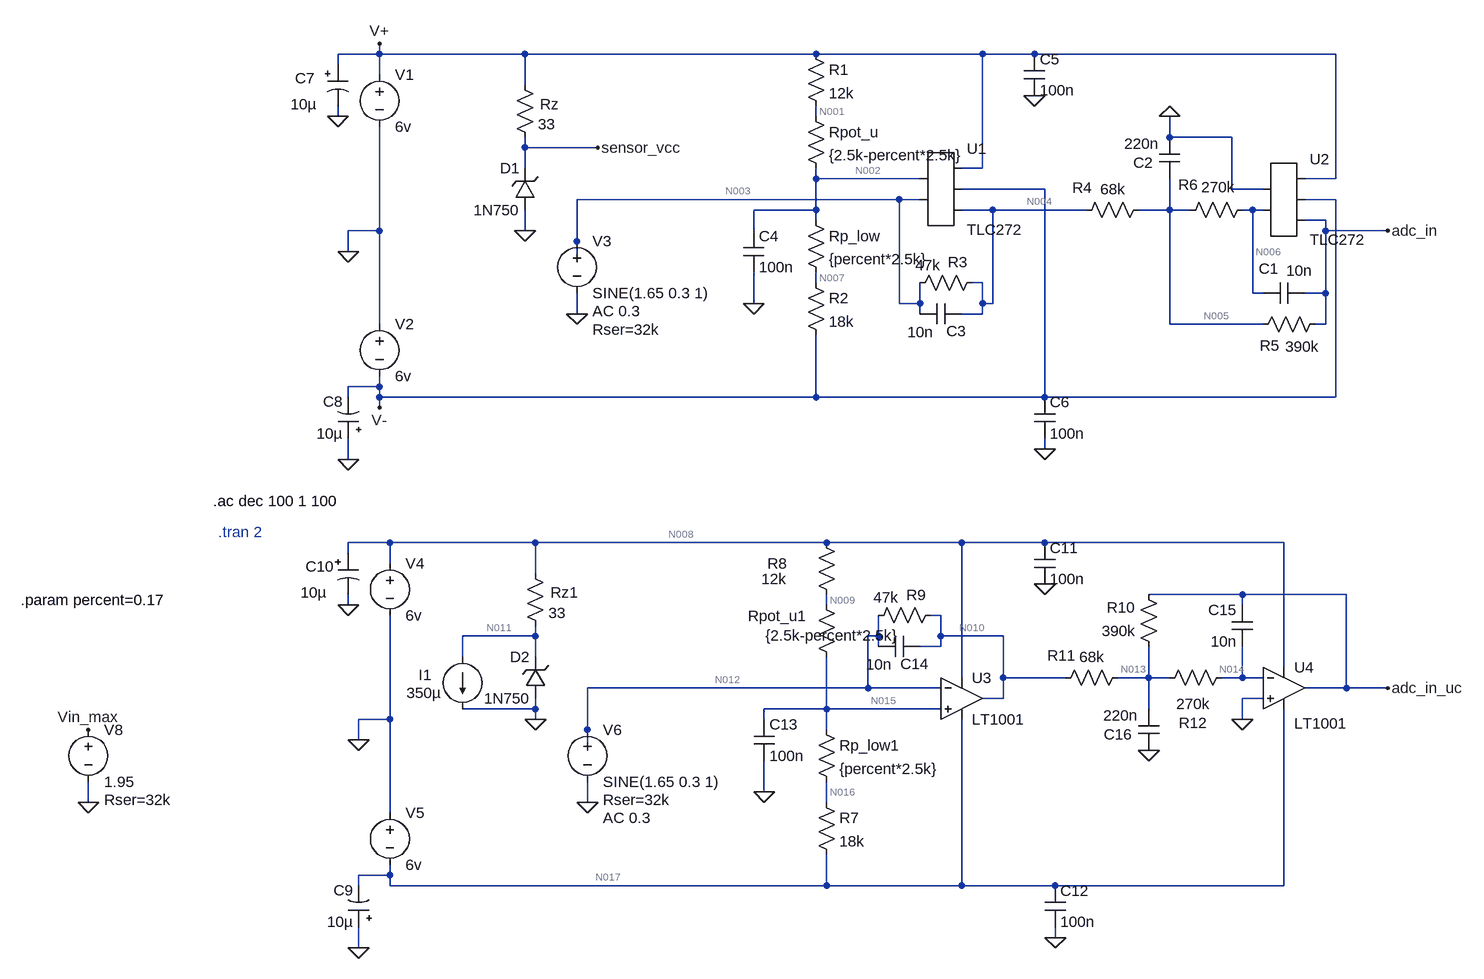
[diagram p0: schematic acceleration_measurement_lab2_draft2.asc]
* acceleration_measurement_lab2_draft2.asc
* U1: TLC272 (symbol AutoGenerated\TLC272 not available, pins judged from their places): pin1=N002 pin2=N003 pin3=V+ pin4=V- pin5=N004
* U2: TLC272 (symbol AutoGenerated\TLC272 not available, pins judged from their places): pin1=0 pin2=N006 pin3=V+ pin4=V- pin5=adc_in
D1 0 sensor_vcc 1N750
Rz V+ sensor_vcc 33
V1 V+ 0 6v
V2 0 V- 6v
V3 N003 0 SINE(1.65 0.3 1) AC 0.3 Rser=32k
C8 0 V- 10µ
C7 V+ 0 10µ
C5 V+ 0 100n
C6 V- 0 100n
R2 N007 V- 18k
Rp_low N002 N007 {percent*2.5k}
R1 V+ N001 12k
Rpot_u N001 N002 {2.5k-percent*2.5k}
C4 N002 0 100n
R3 N004 N003 47k
C3 N004 N003 10n
R5 adc_in N005 390k
R4 N005 N004 68k
R6 N006 N005 270k
C1 adc_in N006 10n
C2 N005 0 220n
D2 0 N011 1N750
Rz1 N008 N011 33
V4 N008 0 6v
V5 0 N017 6v
V6 N012 0 SINE(1.65 0.3 1) AC 0.3 Rser=32k
C9 0 N017 10µ
C10 N008 0 10µ
C11 N008 0 100n
C12 N017 0 100n
R7 N016 N017 18k
Rp_low1 N015 N016 {percent*2.5k}
R8 N008 N009 12k
Rpot_u1 N009 N015 {2.5k-percent*2.5k}
C13 N015 0 100n
R9 N010 N012 47k
C14 N010 N012 10n
R10 N013 adc_in_uc 390k
R11 N013 N010 68k
R12 N014 N013 270k
C15 N014 adc_in_uc 10n
C16 0 N013 220n
XU3 N015 N012 N008 N017 N010 LT1001  ; pins In+ In- V+ V- OUT
XU4 0 N014 N008 N017 adc_in_uc LT1001  ; pins In+ In- V+ V- OUT
I1 N011 0 350µ
V8 Vin_max 0 1.95 Rser=32k
.model D D
.lib standard.dio
.ac dec 100 1 100
* .tran 2
.param percent=0.17
.lib LTC.lib
.backanno
.end

* Results of the author's LTspice run, read from the files saved beside the schematic
* Operating Point, zero values left out:
*   V(n004) = -443.5 mV
*   V(v-) = -6 V
*   V(v+) = 6 V
*   V(n003) = 802 mV
*   V(n002) = 803.1 mV
*   V(adc_in) = 2.536 V
*   V(n006) = -1.135 mV
*   V(sensor_vcc) = 4.735 V
*   V(n007) = 646.2 mV
*   V(n001) = 1.569 V
*   V(n005) = -1.135 mV
*   V(n011) = 4.735 V
*   V(n008) = 6 V
*   V(n017) = -6 V
*   V(n012) = 803.1 mV
*   V(n016) = 646.2 mV
*   V(n015) = 803.1 mV
*   V(n009) = 1.569 V
*   V(n010) = -440.8 mV
*   V(n013) = -3.4 µV
*   V(adc_in_uc) = 2.528 V
*   V(n014) = -3.388 µV
*   V(vin_max) = 1.95 V
*   I(D2) = -37.99 mA
*   I(D1) = -38.33 mA
*   I(I1) = 350 µA
*   I(R11) = 6.483 µA
*   I(R10) = -6.483 µA
*   I(R9) = -26.47 µA
*   I(Rpot_u1) = 369.2 µA
*   I(R8) = 369.2 µA
*   I(Rp_low1) = 369.2 µA
*   I(R7) = 369.2 µA
*   I(Rz1) = 38.34 mA
*   I(R6) = -1.724 pA
*   I(R4) = 6.506 µA
*   I(R5) = 6.506 µA
*   I(R3) = -26.5 µA
*   I(Rpot_u) = 369.2 µA
*   I(R1) = 369.2 µA
*   I(Rp_low) = 369.2 µA
*   I(R2) = 369.2 µA
*   I(Rz) = 38.33 mA
*   I(V6) = -26.47 µA
*   I(V5) = -4.882 mA
*   I(V4) = -43.2 mA
*   I(V3) = -26.5 µA
*   I(V2) = -2.269 mA
*   I(V1) = -40.6 mA
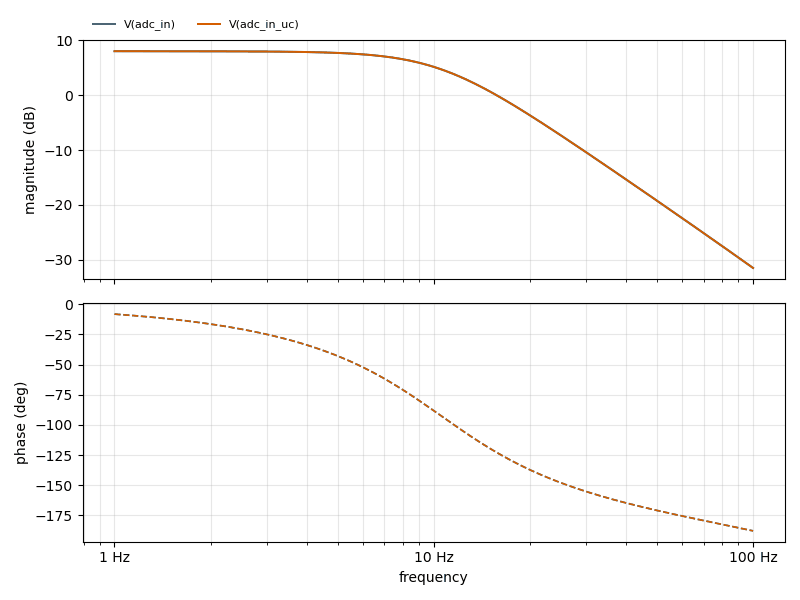
[diagram p1: AC Analysis of acceleration_measurement_lab2_draft2.asc, plotted from the saved traces]
* AC Analysis, 1 run:
*   V(adc_in): 8.05 dB at 1 Hz, -31.54 dB at 100 Hz, peak 8.05 dB at 1 Hz, 3 dB below the peak at 10.18 Hz
*   V(adc_in_uc): 8.05 dB at 1 Hz, -31.54 dB at 100 Hz, peak 8.05 dB at 1 Hz, 3 dB below the peak at 10.18 Hz